# EAGLE schematic aixplorer_battery_pack (EAGLE 6.3)
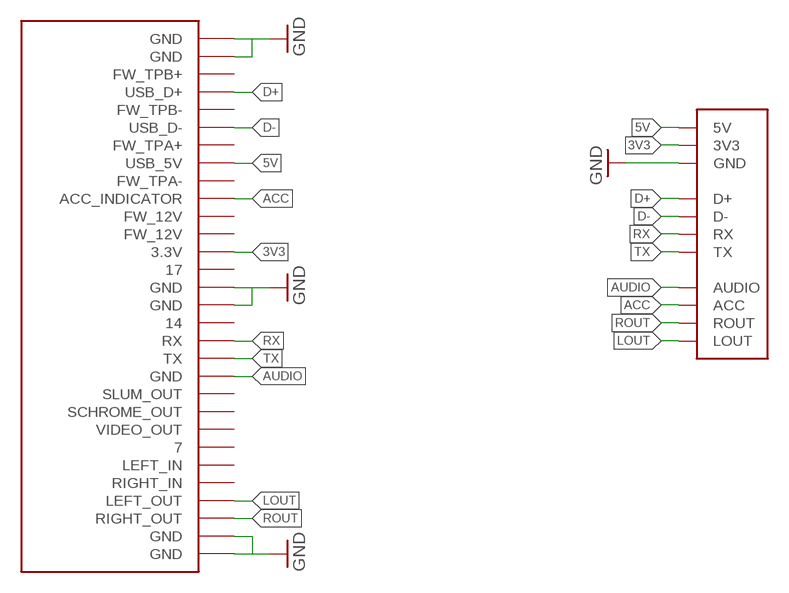
[diagram p0: schematic, sheet 1]

## Parts
U$1  IPAD_CONNECTOR_MALEP  [IPOD_CONNECTOR_MALE_UPRIGHT]
U$2  BATTERY_ADAPTER  [BATTERY_ADAPTER]

## Nets
3V3: U$1.P$18(3.3V) U$2.P$10(3V3)
5V: U$1.P$23(USB_5V) U$2.P$2(5V)
ACC: U$1.P$21(ACC_INDICATOR) U$2.P$1(ACC)
AUDIO: U$1.P$11(GND) U$2.P$11(AUDIO)
D+: U$1.P$27(USB_D+) U$2.P$6(D+)
D-: U$1.P$25(USB_D-) U$2.P$5(D-)
GND: U$1.P$1(GND) U$1.P$2(GND) U$1.P$15(GND) U$1.P$16(GND) U$1.P$29(GND) U$1.P$30(GND) U$2.P$9(GND)
LOUT: U$1.P$4(LEFT_OUT) U$2.P$7(LOUT)
ROUT: U$1.P$3(RIGHT_OUT) U$2.P$8(ROUT)
RX: U$1.P$13(RX) U$2.P$4(RX)
TX: U$1.P$12(TX) U$2.P$3(TX)
Unconnected: U$1.P$5(RIGHT_IN) U$1.P$6(LEFT_IN) U$1.P$7 U$1.P$8(VIDEO_OUT) U$1.P$9(SCHROME_OUT) U$1.P$10(SLUM_OUT) U$1.P$14 U$1.P$17 U$1.P$19(FW_12V) U$1.P$20(FW_12V) U$1.P$22(FW_TPA-) U$1.P$24(FW_TPA+) U$1.P$26(FW_TPB-) U$1.P$28(FW_TPB+)

## Library data of the parts
U$1 = corona:IPAD_CONNECTOR_MALE
U$2 = corona:BATTERY_ADAPTER